# EAGLE design main_top (EAGLE 9.6.2)
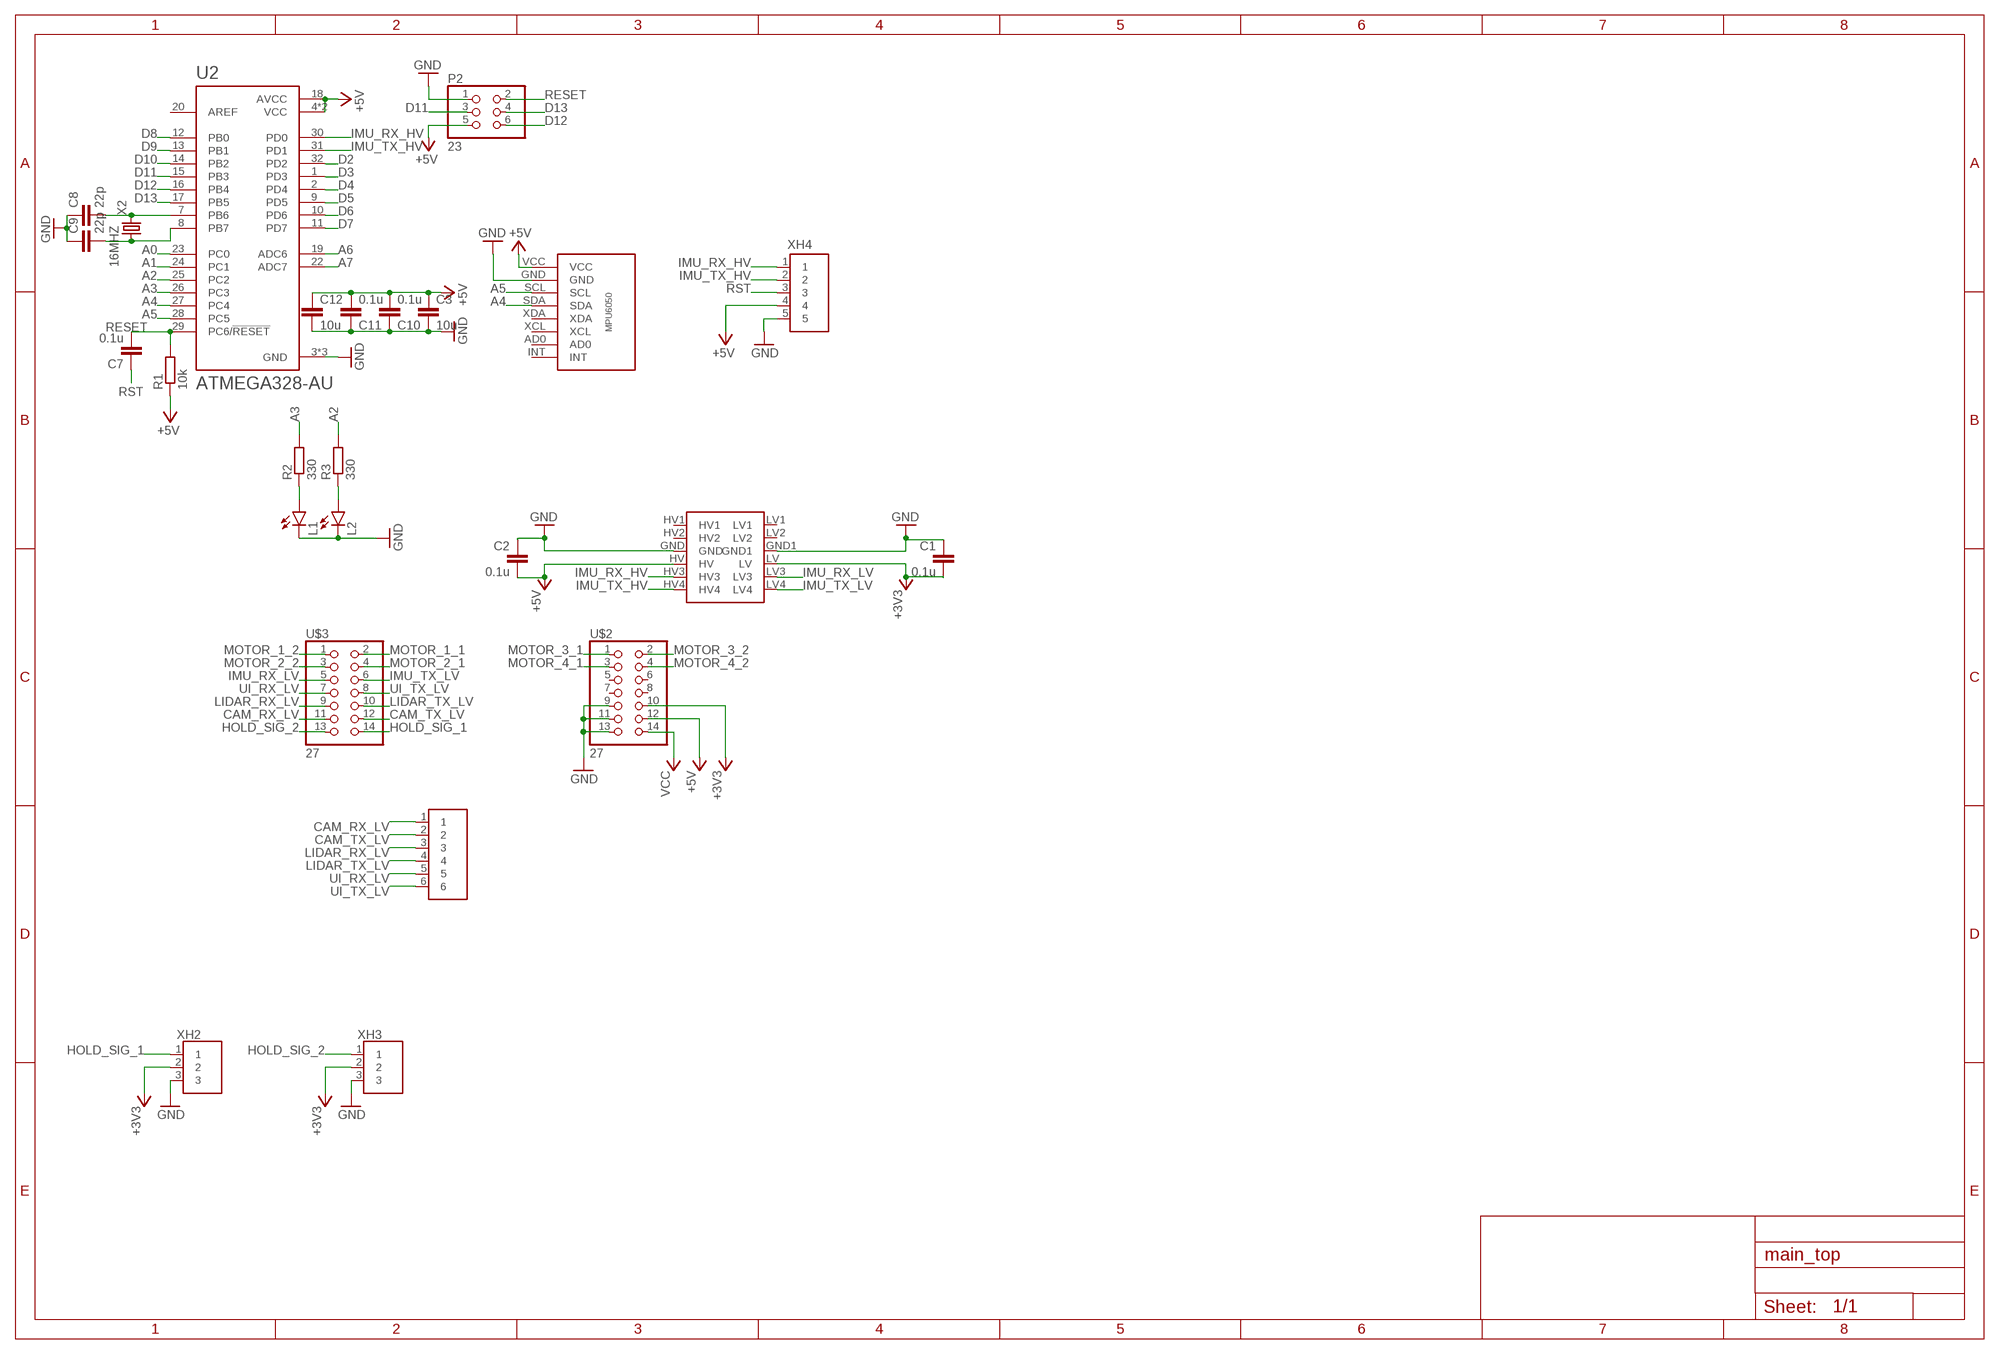
[diagram p0: schematic, sheet 1]

## Parts
C1  0.1u  C-EUC0603  [C0603]
C2  0.1u  C-EUC0603  [C0603]
C3  10u  C-EUC0805  [C0805]
C7  0.1u  C-EUC0603  [C0603]
C8  22p  C-EUC0603  [C0603]
C9  22p  C-EUC0603  [C0603]
C10  0.1u  C-EUC0603  [C0603]
C11  0.1u  C-EUC0603  [C0603]
C12  10u  C-EUC0805  [C0805]
L1  SML-E12P8WT86  [LED_SML-LXFM0603SIC-TR]
L2  SML-E12P8WT86  [LED_SML-LXFM0603SIC-TR]
P2  23  [2*3]
Q1  BSS138  [BSS138]
R1  10k  R-EU_0204/5  [0204/5]
R2  330  R-EU_0204/5  [0204/5]
R3  330  R-EU_0204/5  [0204/5]
U2  ATMEGA328-AU  [QFP80P900X900X120-32N]
U$1  MPU6050  [MPU6050]
U$2  27  [2*7]
U$3  27  [2*7]
X2  16MHZ  [16MHZ]
XH1  S6B  [S6B]
XH2  S3B  [S3B]
XH3  S3B  [S3B]
XH4  S5B  [S5B]

## Nets
+3V3: C1.2 Q1.LV U$2.10 XH2.2 XH3.2
+5V: C2.2 C3.1 C10.2 C11.2 C12.1 P2.5 Q1.HV R1.1 U2.4(VCC) U2.6(VCC) U2.18(AVCC) U$1.VCC U$2.12 XH4.4
A0: U2.23(PC0)
A1: U2.24(PC1)
A2: R3.2 U2.25(PC2)
A3: R2.2 U2.26(PC3)
A4: U2.27(PC4) U$1.SDA
A5: U2.28(PC5) U$1.SCL
A6: U2.19(ADC6)
A7: U2.22(ADC7)
CAM_RX_LV: U$3.11 XH1.1
CAM_TX_LV: U$3.12 XH1.2
D2: U2.32(PD2)
D3: U2.1(PD3)
D4: U2.2(PD4)
D5: U2.9(PD5)
D6: U2.10(PD6)
D7: U2.11(PD7)
D8: U2.12(PB0)
D9: U2.13(PB1)
D10: U2.14(PB2)
D11: P2.3 U2.15(PB3)
D12: P2.6 U2.16(PB4)
D13: P2.4 U2.17(PB5)
GND: C1.1 C2.1 C3.2 C8.1 C9.1 C10.1 C11.1 C12.2 L1.C L2.C P2.1 Q1.GND Q1.GND1 U2.3(GND) U2.5(GND) U2.21(GND) U$1.GND U$2.9 U$2.11 U$2.13 XH2.3 XH3.3 XH4.5
HOLD_SIG_1: U$3.14 XH2.1
HOLD_SIG_2: U$3.13 XH3.1
IMU_RX_HV: Q1.HV3 U2.30(PD0) XH4.1
IMU_RX_LV: Q1.LV3 U$3.5
IMU_TX_HV: Q1.HV4 U2.31(PD1) XH4.2
IMU_TX_LV: Q1.LV4 U$3.6
LIDAR_RX_LV: U$3.9 XH1.3
LIDAR_TX_LV: U$3.10 XH1.4
MOTOR_1_1: U$3.2
MOTOR_1_2: U$3.1
MOTOR_2_1: U$3.4
MOTOR_2_2: U$3.3
MOTOR_3_1: U$2.1
MOTOR_3_2: U$2.2
MOTOR_4_1: U$2.3
MOTOR_4_2: U$2.4
N$1: C8.2 U2.7(PB6) X2.P$2
N$2: C9.2 U2.8(PB7) X2.P$1
N$3: L1.A R2.1
N$8: L2.A R3.1
RESET: C7.2 P2.2 R1.2 U2.29(PC6/!RESET)
RST: C7.1 XH4.3
UI_RX_LV: U$3.7 XH1.5
UI_TX_LV: U$3.8 XH1.6
VCC: U$2.14
Unconnected: Q1.HV1 Q1.HV2 Q1.LV1 Q1.LV2 U2.20(AREF) U$1.AD0 U$1.INT U$1.XCL U$1.XDA U$2.5 U$2.6 U$2.7 U$2.8

## Library data of the parts
C1-C3 C7-C12 = rcl:C-EU: CAPACITOR, European symbol; SPICEPREFIX: C
L1 L2 = LED:SML-E12P8WT86
P2 = pin_socket:2*3
Q1 = logic_level:BSS138
R1-R3 = rcl:R-EU_: RESISTOR, European symbol; SPICEPREFIX: R
U2 = ATMEGA328-AU:ATMEGA328-AU: ATmega Series 20 MHz 32 KB Flash 2 KB SRAM 8-Bit Microcontroller - TQFP-32 Check availability <https://pricing.snapeda.com/parts/ATMEGA328-AU/Microchip/view-part?ref=eda>; AVAILABILITY: In Stock; DESCRIPTION: AVR AVR® ATmega Microcontroller IC 8-Bit 20MHz 32KB (16K x 16) FLASH 32-TQFP (7x7); MF: Microchip; MP: ATMEGA328-AU; PACKAGE: TQFP-32 Microchip; PRICE: None; PURCHASE-URL: https://pricing.snapeda.com/search/part/ATMEGA328-AU/?ref=eda
U$1 = MPU6050:MPU6050
U$2 U$3 = pin_socket:2*7
X2 = crystal:16MHZ
XH1 = XH:S6B
XH2 XH3 = XH:S3B
XH4 = XH:S5B

## Board
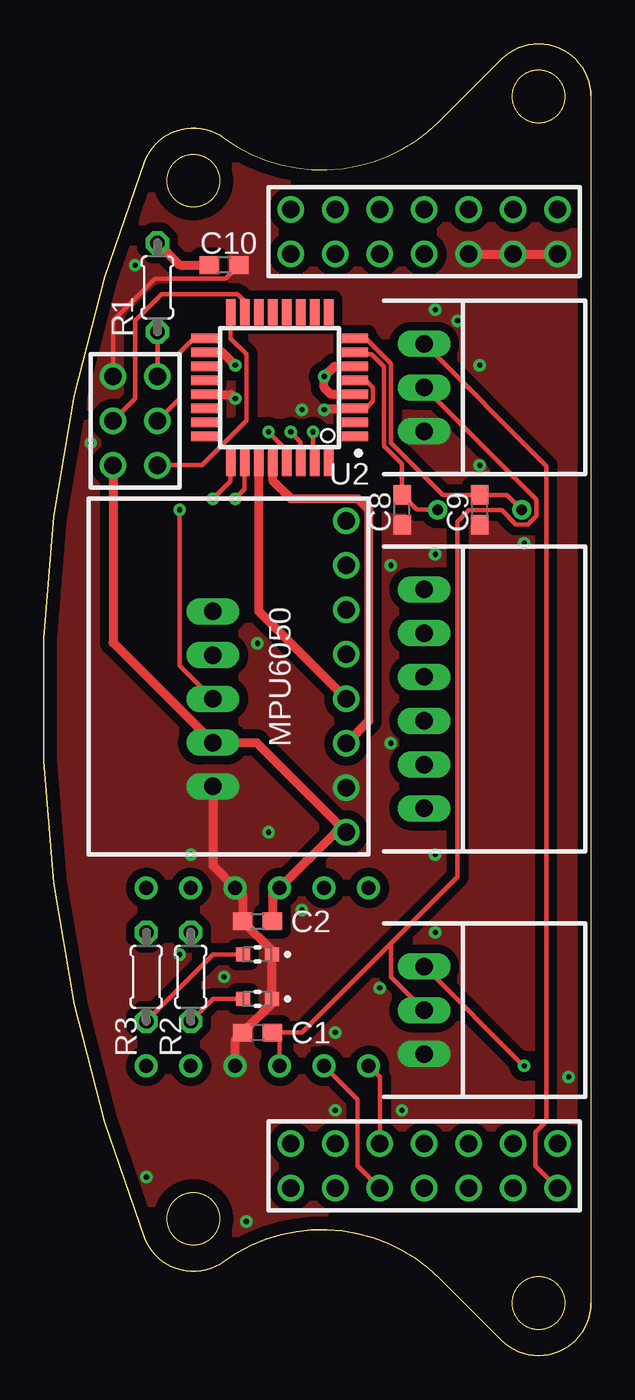
[diagram p1: board, top side]
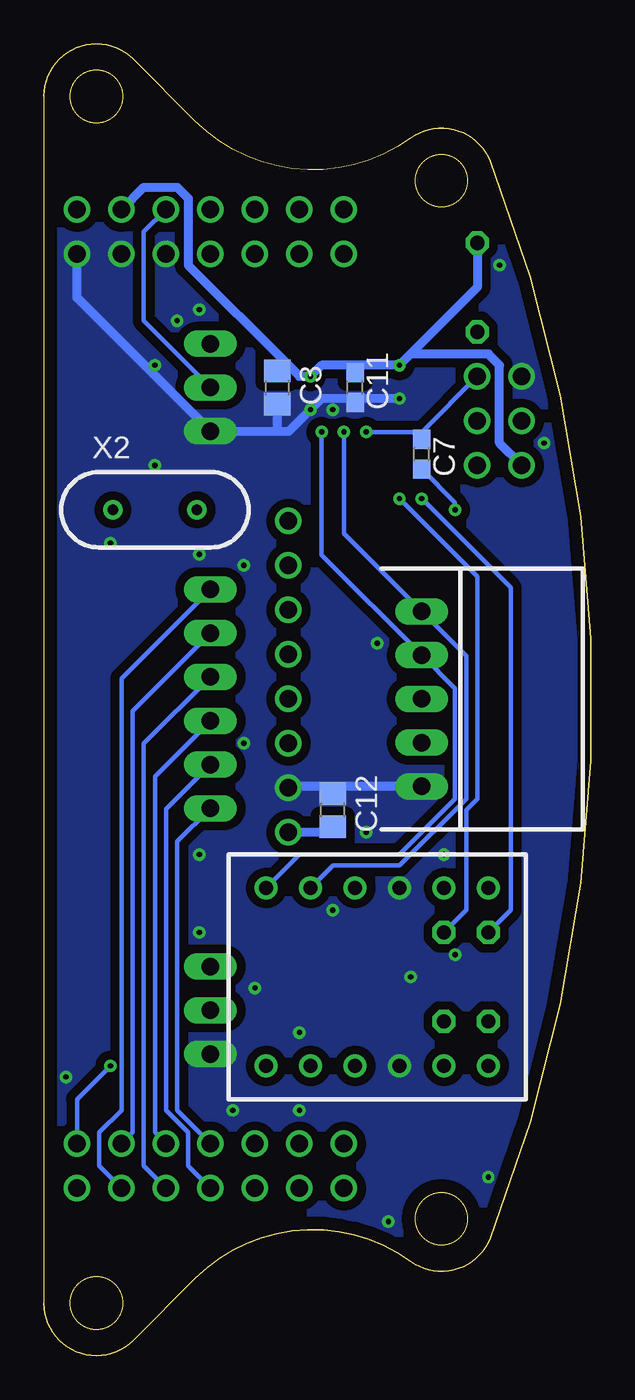
[diagram p2: board, bottom side, seen from below]

Size 31.26 x 74.91 mm. Coordinates in mm from the lower left corner, seen from the top.
Outline: 10.31,69.53 arc104 5.75,68.19
Outline: 5.75,68.19 arc43 5.75,6.72
Outline: 5.75,6.72 arc104 10.31,5.39
Outline: 10.31,5.39 arc-81 22.6,4.41
Outline: 22.6,4.41 26.14,0.88
Outline: 26.14,0.88 arc135 31.26,3
Outline: 31.26,71.91 arc135 26.14,74.03
Outline: 22.6,4.41 arc81 10.31,5.39
Outline: 10.31,5.39 arc-104 5.75,6.72
Outline: 5.75,6.72 arc-43 5.75,68.19
Outline: 5.75,68.19 arc-104 10.31,69.53
Outline: 10.31,69.53 arc81 22.6,70.5 26.14,74.03
Outline: 26.14,74.03 arc-135 31.26,71.91
Outline: 31.26,71.91 31.26,3
Outline: 31.26,3 arc-135 26.14,0.88
Outline: circle at 8.55,7.82 radius 1.5
Outline: circle at 28.26,71.91 radius 1.5
Outline: circle at 8.55,67.1 radius 1.5
Outline: circle at 28.26,3 radius 1.5
Copper layers (1*16): Top 0.035mm / dielectric 1.5mm / Bottom 0.035mm
Design rules "default *": minimum track width 6mil, minimum drill 0.3mm, track to track 6mil, track to pad 6mil, pad to pad 6mil, via to via 6mil, smd to smd 6mil, copper to edge 30mil, drill to drill 6mil, minimum pad ring 10mil, minimum via ring 8mil, stop-mask expansion 4mil, vias tented up to drill 0mil, thermal gap 10mil

### Footprints (pad centres in the part's own frame; a part is rotated, then mirrored left to right if it is on the bottom)
C0603 = smd 1.1 x 1: 1 -0.85,0; 2 0.85,0
C0805 = smd 1.3 x 1.5: 1 -0.95,0; 2 0.95,0
LED_SML-LXFM0603SIC-TR = smd 0.8 x 0.8: A 0.825,0; C -0.825,0
2*3 = drill 1: 1 -1.27,2.54; 2 1.27,2.54; 3 -1.27,0; 4 1.27,0; 5 -1.27,-2.54; 6 1.27,-2.54
BSS138 = drill 0.8: GND -5.08,1.27; GND1 5.08,1.27; HV -5.08,-1.27; HV1 -5.08,6.35; HV2 -5.08,3.81; HV3 -5.08,-3.81; HV4 -5.08,-6.35; LV 5.08,-1.27; LV1 5.08,6.35; LV2 5.08,3.81; LV3 5.08,-3.81; LV4 5.08,-6.35
0204/5 = drill 0.813 octagon: 1 -2.54,0; 2 2.54,0
QFP80P900X900X120-32N = smd 1.5 x 0.55: 1 -4.3,2.8; 2 -4.3,2; 3 -4.3,1.2; 4 -4.3,0.4; 5 -4.3,-0.4; 6 -4.3,-1.2; 7 -4.3,-2; 8 -4.3,-2.8; 17 4.3,-2.8; 18 4.3,-2; 19 4.3,-1.2; 20 4.3,-0.4; 21 4.3,0.4; 22 4.3,1.2; 23 4.3,2; 24 4.3,2.8 | smd 0.55 x 1.5: 9 -2.8,-4.3; 10 -2,-4.3; 11 -1.2,-4.3; 12 -0.4,-4.3; 13 0.4,-4.3; 14 1.2,-4.3; 15 2,-4.3; 16 2.8,-4.3; 25 2.8,4.3; 26 2,4.3; 27 1.2,4.3; 28 0.4,4.3; 29 -0.4,4.3; 30 -1.2,4.3; 31 -2,4.3; 32 -2.8,4.3
MPU6050 = drill 1: AD0 0,-6.35; GND 0,6.35; INT 0,-8.89; SCL 0,3.81; SDA 0,1.27; VCC 0,8.89; XCL 0,-3.81; XDA 0,-1.27
2*7 = drill 1: 1 -1.27,7.62; 2 1.27,7.62; 3 -1.27,5.08; 4 1.27,5.08; 5 -1.27,2.54; 6 1.27,2.54; 7 -1.27,0; 8 1.27,0; 9 -1.27,-2.54; 10 1.27,-2.54; 11 -1.27,-5.08; 12 1.27,-5.08; 13 -1.27,-7.62; 14 1.27,-7.62
16MHZ = drill 0.6: P$1 -2.4,0; P$2 2.4,0
S6B = drill 1 long: 1 0,6.25; 2 0,3.75; 3 0,1.25; 4 0,-1.25; 5 0,-3.75; 6 0,-6.25
S3B = drill 1 long: 1 0,2.5; 2 0,0; 3 0,-2.5
S5B = drill 1 long: 1 0,5; 2 0,2.5; 3 0,0; 4 0,-2.5; 5 0,-5

### Placement (x,y rotation side)
C1  12.21,18.46 0 top
C2  12.21,24.81 0 top
C3  17.92,55.29 270 bottom
C7  9.67,51.48 90 bottom
C8  20.46,48.3 90 top
C9  24.91,48.3 90 top
C10  10.3,62.27 180 top
C11  13.48,55.29 90 bottom
C12  14.75,31.16 90 bottom
L1  12.21,20.36 180 top
L2  12.21,22.9 180 top
P2  5.22,53.38 0 top
Q1  12.21,21.63 270 bottom
R1  6.49,61 270 top
R2  8.4,21.63 90 top
R3  5.86,21.63 90 top
U2  13.48,55.29 180 top
U$1  17.29,38.78 180 top
U$2  21.73,64.18 90 top
U$3  21.73,10.84 90 top
X2  24.91,48.3 0 bottom
XH1  21.73,37.51 0 top
XH2  21.73,19.73 0 top
XH3  21.73,55.29 0 top
XH4  9.67,37.51 0 bottom

### Tracks (layer width: path | path; a pad name or v marks a point on that pad's centre or on a via)
+3V3
  Top 0.25: XH3.2 28.14,48.88 28.14,47.96 27.65,47.47 26.96,47.47 26.15,48.28 24.29,48.28 23.64,47.62 23.64,27.35 19.83,23.54 | 19.83,23.54 19.83,21.63 XH2.2 | 19.83,23.54 14.75,18.46 C1.2 13.48,18.04 Q1.LV
  Bottom 0.25: U$2.10 25.54,64.18 25.54,59.1 XH3.2
+5V  (via drill 0.3)
  Top 0.5: U2.6 16.58,56.49 v16.02,55.92 16.02,55.29 16.42,54.89 U2.4 | U2.18 10.21,57.29 v10.94,56.56 | R1.1 7.76,62.27 C10.2 | P2.5 3.95,40.72 XH4.4 12.17,35.01 U$1.VCC 16.65,29.89 Q1.HV 13.06,26.29 C2.2
  Bottom 0.5: U$2.12 25.54,66.72 23.64,66.72 23,66.08 23,62.27 17.29,56.56 | 17.29,56.56 16.65,55.92 v16.02,55.92 15.38,56.56 13.48,56.56 | 13.48,56.56 v10.94,56.56 10.3,57.19 | C11.2 13.48,56.56 | P2.5 5.22,52.11 5.22,56.56 5.86,57.19 10.3,57.19 | R1.1 6.49,61 10.3,57.19 | C12.1 15.07,29.89 U$1.VCC | C3.1 17.61,56.24 17.29,56.56
A2  (via drill 0.3)
  Top 0.25: v9.67,48.94 10.68,49.95 U2.25
  Bottom 0.25: R3.2 4.59,25.44 4.59,43.86 v9.67,48.94
A3  (via drill 0.3)
  Top 0.25: U2.26 11.48,49.48 v10.94,48.94
  Bottom 0.25: v10.94,48.94 6.49,44.49 6.49,31.79 7.13,31.16 7.13,25.44 R2.2
A4
  Top 0.5: U2.27 12.28,42.52 U$1.SDA
A5
  Top 0.5: U2.28 13.08,49.97 14.11,48.94 17.92,48.94 18.56,48.3 18.56,36.24 U$1.SCL
CAM_RX_LV
  Bottom 0.25: U$3.11 28.08,10.84 28.08,12.74 26.81,14.01 26.81,38.68 XH1.1
CAM_TX_LV
  Bottom 0.25: XH1.2 26.18,36.81 26.18,12.74 U$3.12
D11
  Top 0.25: P2.3 5.22,54.65 5.22,59.1 6.74,60.61 9.28,60.61 9.67,60.61 11.07,60.61 11.48,60.2 U2.15
D12
  Top 0.25: P2.6 9.03,50.84 11.57,53.38 11.57,57.19 10.68,58.09 U2.16
D13
  Top 0.25: P2.4 7.76,54.65 7.76,57.29 8.56,58.09 U2.17
GND  (via drill 0.3)
  Top 0.25: U2.5 18.39,55.69 18.8,55.28 18.8,54.5 18.39,54.09 U2.3 | C10.1 10.38,61.5 6.35,61.5 3.95,59.1 P2.1
  Top 0.5: U2.21 10.7,54.89 v10.94,54.65 | v16.02,54.02 16.09,54.09 U2.3 | U$2.9 U$2.11 U$2.13 | XH4.5 9.67,27.98 Q1.GND 11.36,26.29 C2.1 13.03,23.13 L2.C L1.C 13.03,20.13 C1.1 10.94,18.04 Q1.GND1
  Bottom 0.5: v10.94,54.65 13.48,54.65 | 13.48,54.65 15.38,54.65 v16.02,54.02 17.25,52.79 17.92,52.79 | XH4.5 14.75,32.51 | 14.75,32.51 17.21,32.51 U$1.GND | C11.1 13.48,54.65 | U$2.13 29.35,60.41 XH3.3 17.92,52.79 | C12.2 14.75,32.51 | C3.2 17.92,52.79
  other vias: 5.22,62.27 14.75,54.02 23.64,59.1 22.37,59.73 24.91,56.56 29.99,15.92 22.37,24.17 16.65,18.46 19.19,21 10.3,21.63 14.75,25.44 16.65,14.01 20.46,14.01 7.76,22.9 8.4,28.62 12.84,29.89 12.21,40.68 19.83,34.97 2.68,52.11 24.91,50.84 19.83,45.13 22.37,45.76 27.45,46.4 11.57,7.66 5.86,10.2 22.37,28.62
  pour Top (isolate 0.5, no thermals): -3.03,80.69 36.34,80.69 36.34,-3.13 -3.03,-3.13
  pour Bottom (isolate 0.5, no thermals): -3.03,80.69 35.07,80.69 35.07,-3.13 -3.03,-3.13
HOLD_SIG_1  (via drill 0.3)
  Top 0.25: XH2.1 27.41,16.55 v27.45,16.55
  Bottom 0.25: v27.45,16.55 29.35,14.65 U$3.14
HOLD_SIG_2
  Top 0.25: U$3.13 28.08,10.84 28.08,12.74 28.72,13.38 28.72,50.8 XH3.1
IMU_RX_HV  (via drill 0.3)
  Top 0.25: U2.30 14.68,52.18 v14.11,52.75
  Bottom 0.25: v14.11,52.75 14.11,46.95 XH4.1 7.13,39.97 7.13,31.79 10.94,27.98 14.75,27.98 Q1.HV3
IMU_RX_LV
  Top 0.25: U$3.5 17.92,10.84 17.92,14.65 Q1.LV3
IMU_TX_HV  (via drill 0.3)
  Top 0.25: U2.31 15.38,51.08 v15.38,52.75
  Bottom 0.25: v15.38,52.75 15.38,45.72 XH4.2 7.76,38.1 7.76,31.79 10.94,28.62 16.65,28.62 Q1.HV4
IMU_TX_LV
  Top 0.25: Q1.LV4 19.19,15.92 U$3.6
LIDAR_RX_LV
  Bottom 0.25: U$3.9 25.54,10.84 25.54,34.95 XH1.3
LIDAR_TX_LV
  Bottom 0.25: XH1.4 24.91,33.08 24.91,12.74 U$3.10
N$1
  Top 0.25: U2.7 17.87,57.19 18.72,57.19 19.43,56.49 19.43,51.95 20.46,50.91 C8.2 21.31,48.3 X2.P$2
N$2
  Top 0.25: X2.P$1 26.46,49.15 C9.2 22.79,49.15 19.83,52.11 19.83,56.65 18.39,58.09 U2.8
N$3
  Top 0.25: R2.1 9.67,20.36 L1.A
N$8
  Top 0.25: L2.A 9.67,22.9 R3.1
RESET  (via drill 0.3)
  Top 0.25: R1.2 P2.2 | v12.84,52.75 13.88,51.71 U2.29
  Bottom 0.25: P2.2 9.67,52.75 | 9.67,52.75 v12.84,52.75 | C7.2 9.67,52.75
RST  (via drill 0.3)
  Top 0.25: v7.76,48.3 7.76,39.41 XH4.3
  Bottom 0.25: C7.1 7.76,48.72 v7.76,48.3
UI_RX_LV
  Bottom 0.25: U$3.7 23,10.84 23,12.74 24.27,14.01 24.27,31.22 XH1.5
UI_TX_LV
  Bottom 0.25: XH1.6 23.64,29.35 23.64,14.01 U$3.8